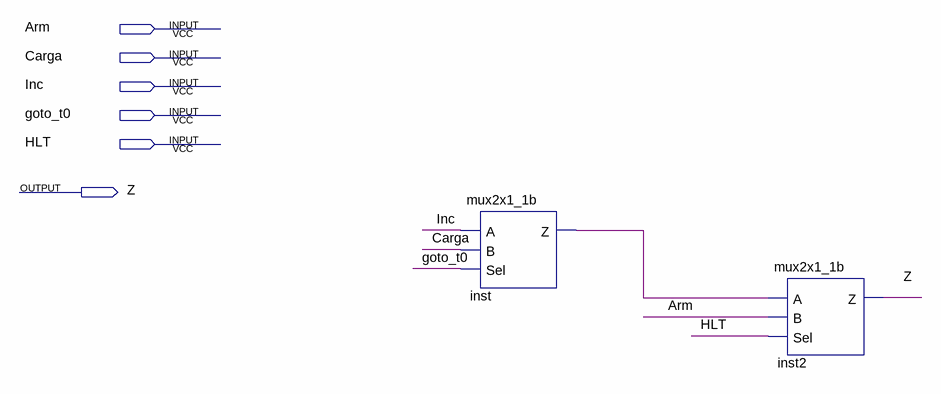
[diagram p0: schematic sheet]
// Quartus schematic mux_temporizador.bdf as structural Verilog: 2 symbols, 6 pins
module mux_temporizador (
  input  Arm,
  input  Carga,
  input  Inc,
  input  goto_t0,
  input  HLT,
  output Z
);

  wire inst_z;

  mux2x1_1b inst (.A(Inc), .B(Carga), .Sel(goto_t0), .Z(inst_z));
  mux2x1_1b inst2 (.A(inst_z), .B(Arm), .Sel(HLT), .Z(Z));
endmodule
